# Altium schematic sheet power.SchDoc: Power and Connectors
size A4; Author: Pietro Lorefice; DocumentNumber: 1; Revision: A; SheetNumber: 1; SheetTotal: 3
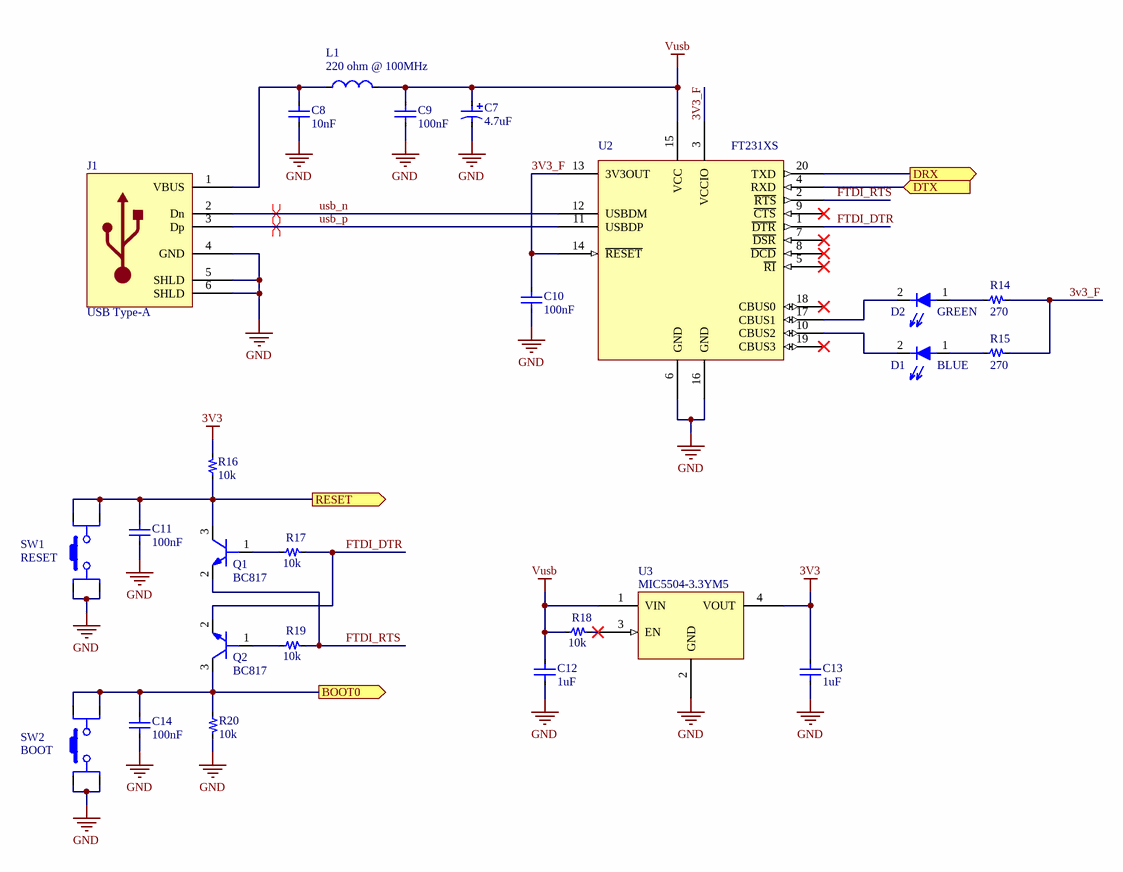
[diagram p0: power.SchDoc]

## Parts
C7  4.7uF  [0603_[1608]]
C8  10nF  [0402_[1005]]
C9  100nF  [0402_[1005]]
C10  100nF  [0402_[1005]]
C11  100nF  [0402_[1005]]
C12  1uF  [0603_[1608]]
C13  1uF  [0603_[1608]]
C14  100nF  [0402_[1005]]
D1  GREEN  [0603_[1608]_K2-A1_LED]
D2  BLUE  [0603_[1608]_K2-A1_LED]
J1  USB Type-A  [MOLEX-48037-0001]
L1  220 ohm @ 100MHz  [1206_[3216]]
Q1  BC817  [SOT95P230X110-3N]
Q2  BC817  [SOT95P230X110-3N]
R14  270  [0402_[1005]]
R15  270  [0402_[1005]]
R16  10k  [0402_[1005]]
R17  10k  [0402_[1005]]
R18  10k  [0402_[1005]]
R19  10k  [0402_[1005]]
R20  10k  [0402_[1005]]
SW1  RESET  [EVQP7A]
SW2  BOOT  [EVQP7A]
U2  FT231XS  [SOP64P600X180-20N]
U3  MIC5504-3.3YM5  [SOT95P280X145-5N]

## Ports
BOOT0 (out), DRX (out), DTX (in), RESET (out)

## Nets
3V3: C13.2 R16.2 U3.4(VOUT)
GND: C7.2 C8.1 C9.1 C10.1 C11.1 C12.1 C13.1 C14.1 J1.4(GND) J1.5(SHLD) J1.6(SHLD) R20.2 SW1.1 SW1.3 SW2.1 SW2.3 U2.6(GND) U2.16(GND) U3.2(GND)
Vusb: C7.1 C9.2 C12.2 L1.2 R18.1 U2.15(VCC) U3.1(VIN)
3V3_F: C10.2 R14.2 R15.2 U2.3(VCCIO) U2.13(3V3OUT) U2.14(~{RESET})
BOOT0: C14.2 Q2.3(C) R20.1 SW2.2 SW2.4 ; port BOOT0
DRX: U2.20(TXD) ; port DRX
DTX: U2.4(RXD) ; port DTX
FTDI_DTR: Q2.2(E) R17.2 U2.1(~{DTR})
FTDI_RTS: Q1.2(E) R19.2 U2.2(~{RTS})
RESET: C11.2 Q1.3(C) R16.1 SW1.2 SW1.4 ; port RESET
usb_n: J1.2(Dn) U2.12(USBDM)
usb_p: J1.3(Dp) U2.11(USBDP)
NetC8_2: C8.2 J1.1(VBUS) L1.1
NetD1_1: D1.1(A) R14.1
NetD1_2: D1.2(K) U2.17(CBUS1)
NetD2_1: D2.1(A) R15.1
NetD2_2: D2.2(K) U2.10(CBUS2)
NetQ1_1: Q1.1(B) R17.1
NetQ2_1: Q2.1(B) R19.1
NetR18_2: R18.2 U3.3(EN)

Not connected (* = marked no-connect by the designer): U2 5(~{RI})* 7(~{DSR})* 8(~{DCD})* 9(~{CTS})* 18(CBUS0)* 19(CBUS3)*

## Layout directives
differential pair: usb_n, usb_p

## Notes on the sheet
- Title
- Project
- Size:
- Date:
- A4
- Number:
- Time:
- Revision:
- Sheet
- of
- Author:

## Library data of the parts
C7 = CPOL: Polarized capacitor; Value: 4.7uF
C8-C14 = C: Capacitor
  C8: Value: 10nF
  C9-C11 C14: Value: 100nF
  C12 C13: Value: 1uF
D1 D2 = LED: Light-emitting diode, 2 pins
J1 = USB-A: pin to pad: 5>Z1 6>Z2
L1 = L: Inductor; Value: 220 ohm @ 100MHz
Q1 Q2 = BC817: BJT NPN transistor
R14-R20 = R: Resistor
  R14 R15: Value: 270
  R16-R20: Value: 10k
SW1 SW2 = SW-PB-4P: Switch, push-button, SPST, 4 pins
U2 = FT231x: USB to full-handshake UART IC
U3 = MIC550x: Single 300mA LDO voltage regulator